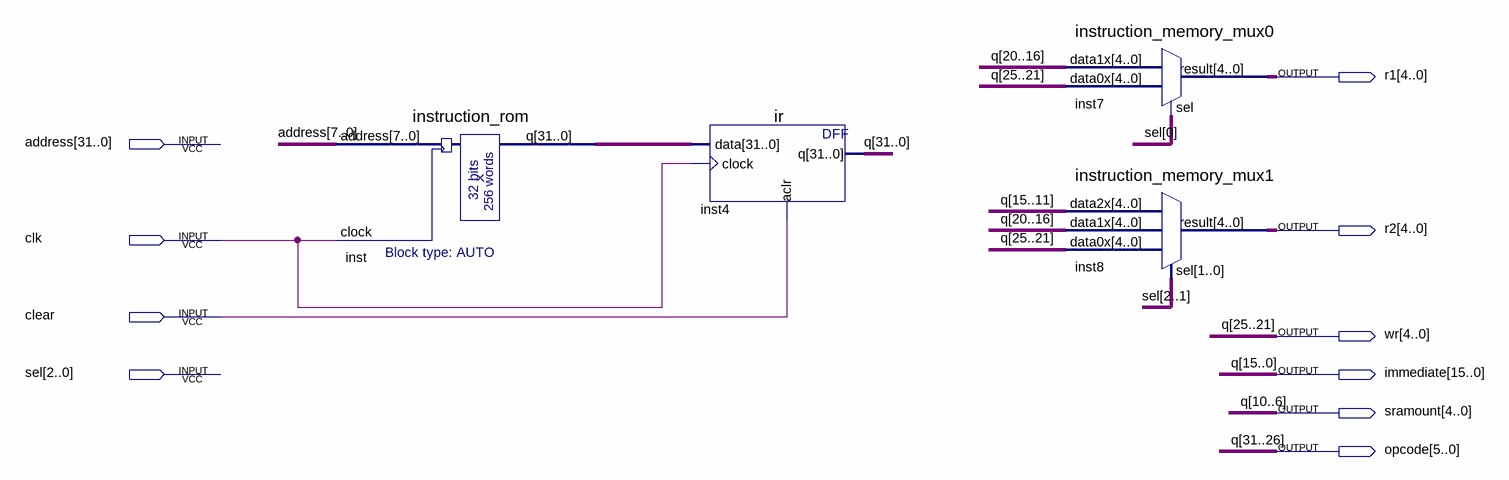
[diagram p0: schematic sheet]
// Quartus schematic Instruction_Memory.bdf as structural Verilog: 4 symbols, 10 pins
module Instruction_Memory (
  input  [31:0] address,
  input  clk,
  input  clear,
  input  [2:0] sel,
  output [4:0] r1,
  output [4:0] r2,
  output [4:0] wr,
  output [15:0] immediate,
  output [4:0] sramount,
  output [5:0] opcode
);

  wire [20:16] q;
  wire [31:0] inst_q;

  instruction_rom inst (.address(address[7:0]), .clock(clk), .q(inst_q));
  ir inst4 (.data(inst_q), .clock(clk), .aclr(clear), .q({opcode, wr, q, immediate}));
  instruction_memory_mux0 inst7 (.data1x(q), .data0x(wr), .sel(sel[0]), .result(r1));
  instruction_memory_mux1 inst8 (.data2x(immediate[15:11]), .data1x(q), .data0x(wr), .sel(sel[2:1]), .result(r2));

  assign sramount = immediate[10:6];

  // Other names for the same wires on the sheet: q (some bits) = {opcode, wr, immediate}
endmodule
